# Altium schematic sheet PA2_Chargeur.SchDoc
size 199 x 119 mm
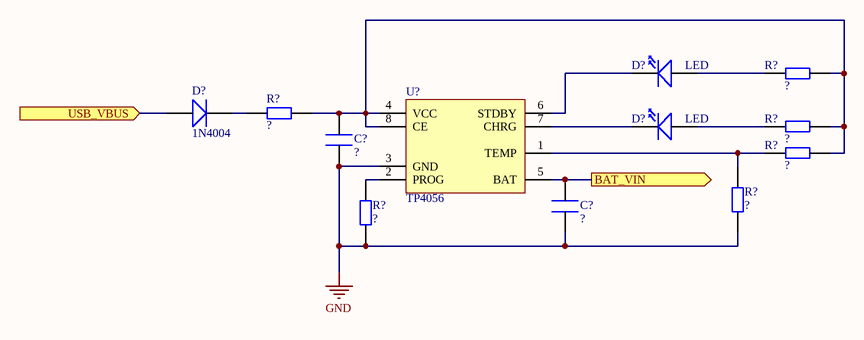
[diagram p0: PA2_Chargeur.SchDoc]

## Parts
(Parts that share a designator on the sheet are numbered #1, #2 ... from top to bottom, then left to right.)
C?#1  Condo  (value not drawn)  (no BOM)
C?#2  Condo  (value not drawn)  (no BOM)
D?#1  LED  (no BOM)
D?#2  1N4004  (no BOM)
D?#3  LED  (no BOM)
R?#1  Res  (value not drawn)  (no BOM)
R?#2  Res  (value not drawn)  (no BOM)
R?#3  Res  (value not drawn)  (no BOM)
R?#4  Res  (value not drawn)  (no BOM)
R?#5  Res  (value not drawn)  (no BOM)
R?#6  Res  (value not drawn)  (no BOM)
U?  TP4056

## Ports
BAT_VIN (out), USB_VBUS (in)

## Nets
GND: C?#1.1 C?#2.1 R?#4.2 R?#6.2 U?.3(GND)
BAT_VIN: C?#2.2 U?.5(BAT) ; port BAT_VIN
USB_VBUS: D?#2.1(+) ; port USB_VBUS
NetC?#1_2: C?#1.2 R?#1.2 R?#2.2 R?#3.2 R?#5.2 U?.4(VCC) U?.8(CE)
NetD?#1_1: D?#1.1(+) R?#1.1
NetD?#1_2: D?#1.2(-) U?.6(STDBY)
NetD?#2_2: D?#2.2(-) R?#2.1
NetD?#3_1: D?#3.1(+) R?#3.1
NetD?#3_2: D?#3.2(-) U?.7(CHRG)
NetR?#4_1: R?#4.1 R?#5.1 U?.1(TEMP)
NetR?#6_1: R?#6.1 U?.2(PROG)

## Library data of the parts
C?#1 C?#2 = Condo: Condensateur; Valeur: ?
D?#1 D?#3 = LED: LED Standard
D?#2 = 1N4004: Diode Standard
R?#1-R?#6 = Res: Résistance; Valeur: ?
U? = TP4056: Adaptateur de charge USB vers Batterie; DataSheet: https://dlnmh9ip6v2uc.cloudfront.net/datasheets/Prototyping/TP4056.pdf